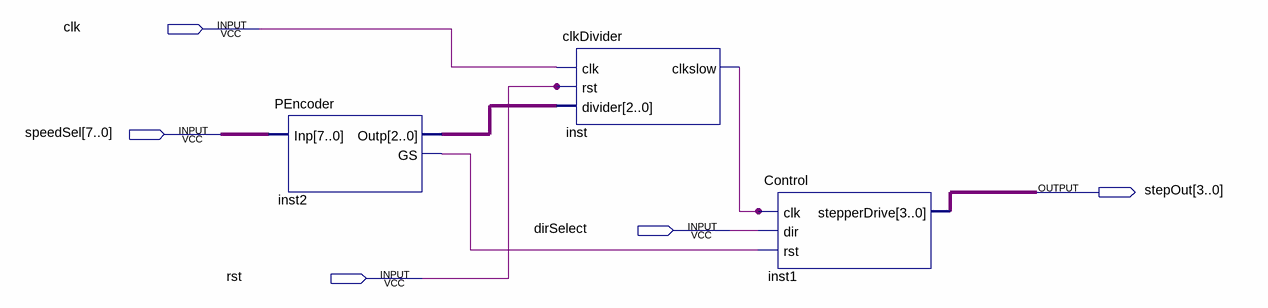
[diagram p0: schematic sheet]
// Quartus schematic StepperMotorbdf.bdf as structural Verilog: 3 symbols, 5 pins
module StepperMotorbdf (
  input  clk,
  input  [7:0] speedSel,
  input  dirSelect,
  input  rst,
  output [3:0] stepOut
);

  wire inst2_gs, inst_clkslow;
  wire [2:0] inst2_outp;

  PEncoder inst2 (.Inp(speedSel), .Outp(inst2_outp), .GS(inst2_gs));
  clkDivider inst (.clk(clk), .rst(rst), .divider(inst2_outp), .clkslow(inst_clkslow));
  Control inst1 (.clk(inst_clkslow), .dir(dirSelect), .rst(inst2_gs), .stepperDrive(stepOut));
endmodule
